# Altium schematic sheet Power.SchDoc
size A; SheetNumber: 8; SheetTotal: 15
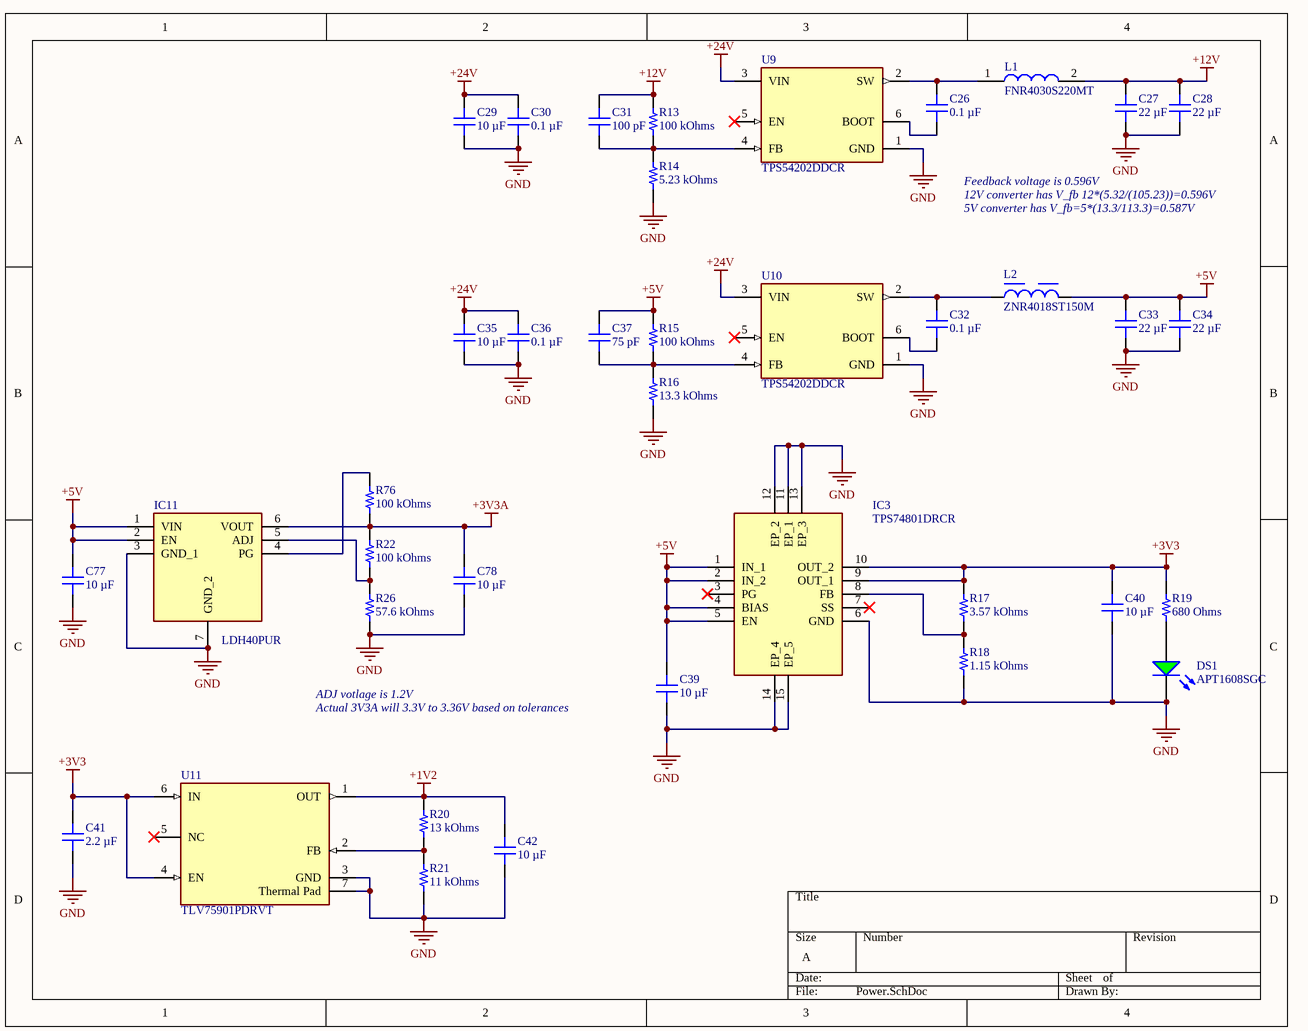
[diagram p0: Power.SchDoc]

## Parts
C26  0.1 µF  [MURATA GCM155 0402_1005]
C27  22 µF  [CAP 0805_2012]
C28  22 µF  [CAP 0805_2012]
C29  10 µF  [CAP 0805_2012]
C30  0.1 µF  [CAP 0402_1005]
C31  100 pF  [CAP 0402_1005]
C32  0.1 µF  [MURATA GCM155 0402_1005]
C33  22 µF  [CAP 0805_2012]
C34  22 µF  [CAP 0805_2012]
C35  10 µF  [CAP 0805_2012]
C36  0.1 µF  [CAP 0402_1005]
C37  75 pF  [MURATA GCM155 0402_1005]
C39  10 µF  [CAP 0402_1005]
C40  10 µF  [CAP 0402_1005]
C41  2.2 µF  [CAP 0402_1005]
C42  10 µF  [CAP 0402_1005]
C77  10 µF  [CAP 0402_1005]
C78  10 µF  [CAP 0402_1005]
DS1  APT1608SGC  [KING-APT1608SGC_V]
IC3  TPS74801DRCR  [TPS74801DRCR]
IC11  LDH40PUR  [SON65P200X200X80-7N]
L1  FNR4030S220MT  [VLCF4020]
L2  ZNR4018ST150M  [WE-LQS_4025]
R13  100 kOhms  [RES 0402_1005]
R14  5.23 kOhms  [RES 0402_1005]
R15  100 kOhms  [RES 0402_1005]
R16  13.3 kOhms  [YAGEO RES 0402_1005]
R17  3.57 kOhms  [YAGEO RES 0402_1005]
R18  1.15 kOhms  [RES 0402_1005]
R19  680 Ohms  [YAGEO RES 0402_1005]
R20  13 kOhms  [YAGEO RES 0402_1005]
R21  11 kOhms  [RES 0402_1005]
R22  100 kOhms  [RES 0402_1005]
R26  57.6 kOhms  [RES 0402_1005]
R76  100 kOhms  [RES 0402_1005]
U9  TPS54202DDCR  [FP-DDC0006A-IPC_B]
U10  TPS54202DDCR  [FP-DDC0006A-IPC_B]
U11  TLV75901PDRVT  [FP-DRV0006A-IPC_B]

## Nets
+1V2: C42.2 R20.2 U11.1(OUT)
+3V3: C40.2 C41.2 IC3.9(OUT_1) IC3.10(OUT_2) R17.2 R19.2 U11.4(EN) U11.6(IN)
+3V3A: C78.2 IC11.6(VOUT) R22.2 R76.1
+5V: C33.2 C34.2 C37.2 C39.2 C77.2 IC3.1(IN_1) IC3.2(IN_2) IC3.4(BIAS) IC3.5(EN) IC11.1(VIN) IC11.2(EN) L2.2 R15.2
+12V: C27.2 C28.2 C31.2 L1.2 R13.2
+24V: C29.2 C30.2 C35.2 C36.2 U9.3(VIN) U10.3(VIN)
GND: C27.1 C28.1 C29.1 C30.1 C33.1 C34.1 C35.1 C36.1 C39.1 C40.1 C41.1 C42.1 C77.1 C78.1 DS1.2(K) IC3.6(GND) IC3.11(EP_1) IC3.12(EP_2) IC3.13(EP_3) IC3.14(EP_4) IC3.15(EP_5) IC11.3(GND_1) IC11.7(GND_2) R14.1 R16.1 R18.1 R21.1 R26.1 U9.1(GND) U10.1(GND) U11.3(GND) U11.7(Thermal_Pad)
NetC26_1: C26.1 U9.6(BOOT)
NetC26_2: C26.2 L1.1 U9.2(SW)
NetC31_1: C31.1 R13.1 R14.2 U9.4(FB)
NetC32_1: C32.1 U10.6(BOOT)
NetC32_2: C32.2 L2.1 U10.2(SW)
NetC37_1: C37.1 R15.1 R16.2 U10.4(FB)
NetDS1_1: DS1.1(A) R19.1
NetIC3_8: IC3.8(FB) R17.1 R18.2
NetIC11_4: IC11.4(PG) R76.2
NetIC11_5: IC11.5(ADJ) R22.1 R26.2
NetR20_1: R20.1 R21.2 U11.2(FB)

Not connected (* = marked no-connect by the designer): IC3 3(PG)* 7(SS)*; U9 5(EN)*; U10 5(EN)*; U11 5(NC)*

## Notes on the sheet
- Feedback voltage is 0.596V
- 12V converter has V_fb 12*(5.32/(105.23))=0.596V
- 5V converter has V_fb=5*(13.3/113.3)=0.587V
- ADJ votlage is 1.2V
- (near C39) Actual 3V3A will 3.3V to 3.36V based on tolerances

## Library data of the parts
C26 C32 = GCM155R71E104KE02D: CAP CER 0.1UF 25V X7R 0402; manufacturer: Murata Electronics; Tolerance: ±10%; Part Number: GCM155R71E104KE02D; Capacitance: 0.1 µF; Applications: Automotive; componentlink1description: Datasheet; componentlink1url: https://search.murata.co.jp/Ceramy/image/img/A01X/G101/ENG/GCM155R71E104KE02-01.pdf; componentlink2description: DigiKey Link; componentlink2url: https://www.digikey.com/en/products/detail/murata-electronics/GCM155R71E104KE02D/7363175; Device Package: 0402 (1005 Metric); lastupdated: 7/20/2024 2:04:19 AM; Lifecycle Status: Active; Minimum Order: 1; Mounting Type: Surface Mount, MLCC; Operating Temperature: -55°C ~ 125°C; Package / Case: 0402 (1005 Metric); packaging: TapeAndReel; partid: 2051; Part Status: Active; price: 0.01; Ratings: AEC-Q200; series: GCM; Size / Dimension: 0.039" L x 0.020" W (1.00mm x 0.50mm); Supplier 1: DigiKey; Supplier Part Number 1: 490-16431-1-ND; Temperature Coefficient: X7R; Thickness (Max): 0.022" (0.55mm); value: 0.1 µF; Voltage - Rated: 25V
C27 C28 C33 C34 = CL21A226MAYNNNE: CAP CER 22UF 25V X5R 0805; manufacturer: Samsung Electro-Mechanics; Tolerance: ±20%; Part Number: CL21A226MAYNNNE; Capacitance: 22 µF; Applications: General Purpose; componentlink1description: Datasheet; componentlink1url: https://media.digikey.com/pdf/Data%20Sheets/Samsung%20PDFs/CL21A226MAYNNNE_Spec.pdf; componentlink2description: DigiKey Link; componentlink2url: https://www.digikey.com/en/products/detail/samsung-electro-mechanics/CL21A226MAYNNNE/10479857; Device Package: 0805 (2012 Metric); lastupdated: 2/9/2024 8:15:02 PM; Lifecycle Status: Active; Minimum Order: 1; Mounting Type: Surface Mount, MLCC; Operating Temperature: -55°C ~ 85°C; Package / Case: 0805 (2012 Metric); packaging: TapeAndReel; partid: 39209; Part Status: Active; price: 0.04; series: CL; Size / Dimension: 0.079" L x 0.049" W (2.00mm x 1.25mm); Supplier 1: DigiKey; Supplier Part Number 1: 1276-CL21A226MAYNNNECT-ND; Temperature Coefficient: X5R; Thickness (Max): 0.057" (1.45mm); value: 22 µF; Voltage - Rated: 25V
C29 C35 = C0805B106K050T: CAP CER 10UF 50V X5R 0805; manufacturer: Holy Stone Enterprise Co., Ltd.; Tolerance: ±10%; Part Number: C0805B106K050T; Capacitance: 10 µF; Applications: General Purpose; componentlink1description: Datasheet; componentlink1url: https://media.digikey.com/pdf/Data%20Sheets/Holy%20Stone/NCC_Series_DS.pdf; componentlink2description: DigiKey Link; componentlink2url: https://www.digikey.com/en/products/detail/holy-stone-enterprise-co-ltd/C0805B106K050T/16894957; Device Package: 0805 (2012 Metric); lastupdated: 2/9/2024 8:14:45 PM; Lifecycle Status: Active; Minimum Order: 1; Mounting Type: Surface Mount, MLCC; Operating Temperature: -55°C ~ 85°C; Package / Case: 0805 (2012 Metric); packaging: TapeAndReel; partid: 48876; Part Status: Active; price: 0.11; series: NCC; Size / Dimension: 0.079" L x 0.049" W (2.00mm x 1.25mm); Supplier 1: DigiKey; Supplier Part Number 1: 4587-C0805B106K050TCT-ND; Temperature Coefficient: X5R; value: 10 µF; Voltage - Rated: 50V
C30 C36 = CGA2B3X5R1H104M050BB: CAP CER 0.1UF 50V X5R 0402; manufacturer: TDK Corporation; Tolerance: ±20%; Part Number: CGA2B3X5R1H104M050BB; Capacitance: 0.1 µF; Applications: Automotive; componentlink1description: Datasheet; componentlink1url: https://product.tdk.com/info/en/catalog/datasheets/mlcc_automotive_general_en.pdf?ref_disty=digikey; componentlink2description: DigiKey Link; componentlink2url: https://www.digikey.com/en/products/detail/tdk-corporation/CGA2B3X5R1H104M050BB/3949450; Device Package: 0402 (1005 Metric); lastupdated: 2/9/2024 8:04:38 PM; Lifecycle Status: Active; Minimum Order: 1; Mounting Type: Surface Mount, MLCC; Operating Temperature: -55°C ~ 85°C; Package / Case: 0402 (1005 Metric); packaging: TapeAndReel; partid: 1792; Part Status: Active; price: 0.01; Ratings: AEC-Q200; series: CGA; Size / Dimension: 0.039" L x 0.020" W (1.00mm x 0.50mm); Supplier 1: DigiKey; Supplier Part Number 1: 445-12214-1-ND; Temperature Coefficient: X5R; Thickness (Max): 0.022" (0.55mm); value: 0.1 µF; Voltage - Rated: 50V
C31 = 500X07N101MV4T: CAP CER 100PF 50V C0G/NP0 0402; manufacturer: Johanson Dielectrics Inc.; Temperature Coefficient: C0G, NP0; Tolerance: ±20%; Part Number: 500X07N101MV4T; Capacitance: 100 pF; Applications: Bypass, Decoupling; componentlink1description: Datasheet; componentlink1url: https://www.johansondielectrics.com/downloads/x2y-filter-and-decoupling-capacitors.pdf; componentlink2description: DigiKey Link; componentlink2url: https://www.digikey.com/en/products/detail/johanson-dielectrics-inc/500X07N101MV4T/2046917; Device Package: 0402 (1005 Metric); Features: Low ESL (X2Y); lastupdated: 2/9/2024 8:04:38 PM; Lifecycle Status: Active; Minimum Order: 1; Mounting Type: Surface Mount, MLCC; Operating Temperature: -55°C ~ 125°C; Package / Case: 0402 (1005 Metric); packaging: TapeAndReel; partid: 1767; Part Status: Active; price: 0.08; series: X2Y®; Size / Dimension: 0.045" L x 0.025" W (1.14mm x 0.64mm); Supplier 1: DigiKey; Supplier Part Number 1: 709-1214-1-ND; Thickness (Max): 0.020" (0.51mm); value: 100 pF; Voltage - Rated: 50V
C37 = GCM1555C1H750FA16D: CAP CER 75PF 50V C0G/NP0 0402; manufacturer: Murata Electronics; Temperature Coefficient: C0G, NP0; Tolerance: ±1%; Part Number: GCM1555C1H750FA16D; Capacitance: 75 pF; Applications: Automotive; componentlink1description: Datasheet; componentlink1url: https://search.murata.co.jp/Ceramy/image/img/A01X/G101/ENG/GCM1555C1H750FA16-01.pdf; componentlink2description: DigiKey Link; componentlink2url: https://www.digikey.com/en/products/detail/murata-electronics/GCM1555C1H750FA16D/7362941; Device Package: 0402 (1005 Metric); lastupdated: 7/20/2024 2:04:17 AM; Lifecycle Status: Active; Minimum Order: 1; Mounting Type: Surface Mount, MLCC; Operating Temperature: -55°C ~ 125°C; Package / Case: 0402 (1005 Metric); packaging: TapeAndReel; partid: 32579; Part Status: Active; price: 0.01; Ratings: AEC-Q200; series: GCM; Size / Dimension: 0.039" L x 0.020" W (1.00mm x 0.50mm); Supplier 1: DigiKey; Supplier Part Number 1: 490-GCM1555C1H750FA16DCT-ND; Thickness (Max): 0.022" (0.55mm); value: 75 pF; Voltage - Rated: 50V
C39 C40 C42 C77 C78 = CL05A106MP8NUB8: CAP CER 10UF 10V X5R 0402; manufacturer: Samsung Electro-Mechanics; Tolerance: ±20%; Part Number: CL05A106MP8NUB8; Capacitance: 10 µF; Applications: Acoustic Noise Reduction; componentlink1description: Datasheet; componentlink1url: http://www.samsungsem.com/kr/support/product-search/mlcc/CL05A106MP8NUB8.jsp; componentlink2description: DigiKey Link; componentlink2url: https://www.digikey.com/en/products/detail/samsung-electro-mechanics/CL05A106MP8NUB8/5961314; Device Package: 0402 (1005 Metric); lastupdated: 2/9/2024 8:04:38 PM; Lifecycle Status: Active; Minimum Order: 1; Mounting Type: Surface Mount, MLCC; Operating Temperature: -55°C ~ 85°C; Package / Case: 0402 (1005 Metric); packaging: TapeAndReel; partid: 1758; Part Status: Active; price: 0.06; series: CL; Size / Dimension: 0.039" L x 0.020" W (1.00mm x 0.50mm); Supplier 1: DigiKey; Supplier Part Number 1: 1276-6830-1-ND; Temperature Coefficient: X5R; Thickness (Max): 0.035" (0.90mm); value: 10 µF; Voltage - Rated: 10V
C41 = CL05A225KO5NQNC: CAP CER 2.2UF 16V X5R 0402; manufacturer: Samsung Electro-Mechanics; Tolerance: ±10%; Part Number: CL05A225KO5NQNC; Capacitance: 2.2 µF; Applications: General Purpose; componentlink1description: Datasheet; componentlink1url: http://www.samsungsem.com/kr/support/product-search/mlcc/CL05A225KO5NQNC.jsp; componentlink2description: DigiKey Link; componentlink2url: https://www.digikey.com/en/products/detail/samsung-electro-mechanics/CL05A225KO5NQNC/3887119; Device Package: 0402 (1005 Metric); lastupdated: 2/9/2024 8:04:38 PM; Lifecycle Status: Active; Minimum Order: 1; Mounting Type: Surface Mount, MLCC; Operating Temperature: -55°C ~ 85°C; Package / Case: 0402 (1005 Metric); packaging: TapeAndReel; partid: 1761; Part Status: Active; price: 0.03; series: CL; Size / Dimension: 0.039" L x 0.020" W (1.00mm x 0.50mm); Supplier 1: DigiKey; Supplier Part Number 1: 1276-1461-1-ND; Temperature Coefficient: X5R; Thickness (Max): 0.022" (0.55mm); value: 2.2 µF; Voltage - Rated: 16V
DS1 = CMP-2000-05789-1: Super Bright Green LED, 62.5 mW, 25 mA, -40 to 85 degC, 2-Pin SMD, RoHS, Tape and Reel; Manufacturer: Kingbright; Online Catalog: 0603RectanglewithFlatTopChipLEDs; Wavelength - Dominant: 568nm; Wavelength - Peak: 565nm; Voltage - Forward (Vf) (Typ): 2.2V; Lens Type: Clear; Other Names: 754-1121-2; Millicandela Rating: 15mcd; Catalog Drawings: APT1608SeriesTop / APT1608SeriesSide; Lens Style/Size: RectanglewithFlatTop,1.2mmx0.8mm; Current - Test: 20mA; 3D Model: APT1608x.sldprt / APT1608x.pro / APT1608x.igs / APT1608x.stp; Viewing Angle: 120°; Package / Case: 0603(1608Metric); Category: Optoelectronics; Package Description: 2-Pin Surface Mount Device, Body 0.8 x 1.6 mm; Mounting Type: SurfaceMount; Color: Green; Height: 0.75mm; Datasheet Version: Rev. 16B, 02/2012; Family: LEDIndication-Discrete; Manufacturer URL: http://www.kingbright.com/; Package Reference: APT1608SGC; Datasheet URL: https://datasheet.ciiva.com/2113/apt1608sgc-2113808.pdf; Mounting Technology: SurfaceMount; Packaging: Tape&Reel(TR); Standard Package: 2,000; Size / Dimension: 1.60mmLx0.80mmW
IC3 = TPS74801DRCR: Integrated Circuit; Manufacturer_Name: Texas Instruments; Datasheet Link: https://www.ti.com/lit/gpn/TPS74801; Height: 1mm; Manufacturer_Part_Number: TPS74801DRCR; Mouser Part Number: 595-TPS74801DRCR; Mouser Price/Stock: https://www.mouser.co.uk/ProductDetail/Texas-Instruments/TPS74801DRCR?qs=MiEMpo83RV6vgm8Iaojmyg%3D%3D; Arrow Part Number: TPS74801DRCR; Arrow Price/Stock: https://www.arrow.com/en/products/tps74801drcr/texas-instruments?region=nac
IC11 = LDH40PUR: Integrated Circuit; Manufacturer_Name: STMicroelectronics; Datasheet Link: https://www.st.com/resource/en/datasheet/ldh40.pdf; Height: 0.8mm; Manufacturer_Part_Number: LDH40PUR
L1 = VLCF4020T-220MR56: 22uH Magnetic Shielded Inductor 1.4A SMD,4x4mm Fixed Inductors RoHS; Manufacturer_Name: TDK; Datasheet Link: https://product.tdk.com/system/files/dam/doc/product/inductor/inductor/smd/catalog/inductor_commercial_power_vlcf4020_en.pdf; Manufacturer_Part_Number: VLCF4020T-220MR56; Mouser Part Number: 810-VLCF4020T220MR56; Mouser Price/Stock: https://www.mouser.co.uk/ProductDetail/TDK/VLCF4020T-220MR56?qs=O2qRfqcg9D8DoR1uKFMlTA%3D%3D; Arrow Part Number: VLCF4020T-220MR56; Arrow Price/Stock: https://www.arrow.com/en/products/vlcf4020t-220mr56/tdk?region=nac
L2 = CMP-03913-77814858-1: FIXED IND 15uH 1A 250mΩ SMD,4x4mm; Current Rating: 1.45A; Inductance: 15µH; Inductance Tolerance: 20%; DC Resistance (DCR): 132mΩ; Max Operating Temperature: 125°C; Ambient Temperature Range High: 85°C; Length: 4mm; Ambient Temperature Range Low: -40°C; RoHS: Compliant; Height: 2.5mm; Min Operating Temperature: -40°C; NexarPartId: 77814858; Width: 4mm
R13 R15 R22 R76 = RP73PF1E100KBTD: RES 100K OHM 0.1% 1/10W 0402; Manufacturer: TE Connectivity Passive Product; Power (Watts): 0.1W, 1/10W; Temperature Coefficient: ±25ppm/°C; Part Number: RP73PF1E100KBTD; Value: 100 kOhms; ComponentLink1Description: Datasheet; ComponentLink1URL: https://www.te.com/commerce/DocumentDelivery/DDEController?Action=srchrtrv&DocNm=1773272&DocType=DS&DocLang=English; ComponentLink2Description: DigiKey Link; ComponentLink2URL: https://www.digikey.com/en/products/detail/te-connectivity-passive-product/RP73PF1E100KBTD/8261053; Composition: Thin Film; Device Package: 0402 (1005 Metric); Height - Seated (Max): 0.014" (0.35mm); LastUpdated: 2/9/2024 8:30:24 PM; Lifecycle Status: Active; Minimum Order: 1; Number of Terminations: 2; Operating Temperature: -55°C ~ 155°C; Package / Case: 0402 (1005 Metric); Packaging: TapeAndReel; PartId: 2436; Part Status: Active; Price: 0.08; Resistance: 100 kOhms; Series: RP73, Holsworthy; Size / Dimension: 0.039" L x 0.020" W (1.00mm x 0.50mm); Supplier 1: DigiKey; Supplier Part Number 1: A127511CT-ND; Supplier Device Package: 0402; Tolerance: ±0.1%
R14 = ERJ-2RKF5231X: RES SMD 5.23K OHM 1% 1/10W 0402; Manufacturer: Panasonic Electronic Components; Power (Watts): 0.1W, 1/10W; Temperature Coefficient: ±100ppm/°C; Part Number: ERJ-2RKF5231X; Value: 5.23 kOhms; ComponentLink1Description: Datasheet; ComponentLink1URL: https://industrial.panasonic.com/cdbs/www-data/pdf/RDA0000/AOA0000C304.pdf; ComponentLink2Description: DigiKey Link; ComponentLink2URL: https://www.digikey.com/en/products/detail/panasonic-electronic-components/ERJ-2RKF5231X/192387; Composition: Thick Film; Device Package: 0402 (1005 Metric); Features: Automotive AEC-Q200; Height - Seated (Max): 0.016" (0.40mm); LastUpdated: 2/9/2024 8:30:18 PM; Lifecycle Status: Active; Minimum Order: 1; Number of Terminations: 2; Operating Temperature: -55°C ~ 155°C; Package / Case: 0402 (1005 Metric); Packaging: CutTape; PartId: 3829; Part Status: Active; Price: 0.01; Ratings: AEC-Q200; Resistance: 5.23 kOhms; Series: ERJ-2RK; Size / Dimension: 0.039" L x 0.020" W (1.00mm x 0.50mm); Supplier 1: DigiKey; Supplier Part Number 1: P5.23KLCT-ND; Supplier Device Package: 0402; Tolerance: ±1%
R16 = RC0402FR-0713K3L: RES 13.3K OHM 1% 1/16W 0402; Manufacturer: Yageo; Power (Watts): 0.063W, 1/16W; Temperature Coefficient: ±100ppm/°C; Part Number: RC0402FR-0713K3L; Value: 13.3 kOhms; ComponentLink1Description: Datasheet; ComponentLink1URL: https://www.yageo.com/upload/media/product/productsearch/datasheet/rchip/PYu-RC_Group_51_RoHS_L_10.pdf; ComponentLink2Description: DigiKey Link; ComponentLink2URL: https://www.digikey.com/en/products/detail/yageo/RC0402FR-0713K3L/5280834; Composition: Thick Film; Device Package: 0402 (1005 Metric); Features: Moisture Resistant; Height - Seated (Max): 0.016" (0.40mm); LastUpdated: 8/31/2025 3:04:18 PM; Lifecycle Status: Active; Minimum Order: 1; Number of Terminations: 2; Operating Temperature: -55°C ~ 155°C; Package / Case: 0402 (1005 Metric); Packaging: CutTape; PartId: 2643; Part Status: Active; Price: 0.01; Resistance: 13.3 kOhms; Series: RC_L; Size / Dimension: 0.039" L x 0.020" W (1.00mm x 0.50mm); Supplier 1: DigiKey; Supplier Part Number 1: YAG2974CT-ND; Supplier Device Package: 0402; Tolerance: ±1%
R17 = RC0402FR-073K57L: RES 3.57K OHM 1% 1/16W 0402; Manufacturer: Yageo; Power (Watts): 0.063W, 1/16W; Temperature Coefficient: ±100ppm/°C; Part Number: RC0402FR-073K57L; Value: 3.57 kOhms; ComponentLink1Description: Datasheet; ComponentLink1URL: https://www.yageo.com/upload/media/product/productsearch/datasheet/rchip/PYu-RC_Group_51_RoHS_L_10.pdf; ComponentLink2Description: DigiKey Link; ComponentLink2URL: https://www.digikey.com/en/products/detail/yageo/RC0402FR-073K57L/5281010; Composition: Thick Film; Device Package: 0402 (1005 Metric); Features: Moisture Resistant; Height - Seated (Max): 0.016" (0.40mm); LastUpdated: 8/31/2025 3:04:18 PM; Lifecycle Status: Active; Minimum Order: 1; Number of Terminations: 2; Operating Temperature: -55°C ~ 155°C; Package / Case: 0402 (1005 Metric); Packaging: CutTape; PartId: 2603; Part Status: Active; Price: 0.01; Resistance: 3.57 kOhms; Series: RC_L; Size / Dimension: 0.039" L x 0.020" W (1.00mm x 0.50mm); Supplier 1: DigiKey; Supplier Part Number 1: YAG3150CT-ND; Supplier Device Package: 0402; Tolerance: ±1%
R18 = TNPW04021K15BYEP: TNPW0402 1K15 0.1% T-13 EP1 E3; Manufacturer: Vishay Dale; Power (Watts): 0.063W, 1/16W; Temperature Coefficient: ±10ppm/°C; Part Number: TNPW04021K15BYEP; Value: 1.15 kOhms; ComponentLink1Description: Datasheet; ComponentLink1URL: https://www.vishay.com/docs/28758/tnpw_e3.pdf; ComponentLink2Description: DigiKey Link; ComponentLink2URL: https://www.digikey.com/en/products/detail/vishay-dale/TNPW04021K15BYEP/18883256; Composition: Thin Film; Device Package: 0402 (1005 Metric); Features: Anti-Sulfur, Automotive AEC-Q200, Moisture Resistant; Height - Seated (Max): 0.016" (0.40mm); LastUpdated: 2/9/2024 8:28:23 PM; Lifecycle Status: Active; Minimum Order: 1; Number of Terminations: 2; Operating Temperature: -55°C ~ 155°C; Package / Case: 0402 (1005 Metric); Packaging: TapeAndReel; PartId: 81440; Price: 0.25; Ratings: AEC-Q200; Resistance: 1.15 kOhms; Series: TNPW e3; Size / Dimension: 0.039" L x 0.020" W (1.00mm x 0.50mm); Supplier 1: DigiKey; Supplier Part Number 1: 541-TNPW04021K15BYEPCT-ND; Supplier Device Package: 0402; Tolerance: ±0.1%
R19 = RC0402FR-07680RL: RES 680 OHM 1% 1/16W 0402; Manufacturer: Yageo; Power (Watts): 0.063W, 1/16W; Temperature Coefficient: ±100ppm/°C; Part Number: RC0402FR-07680RL; Value: 680 Ohms; ComponentLink1Description: Datasheet; ComponentLink1URL: https://www.yageo.com/upload/media/product/productsearch/datasheet/rchip/PYu-RC_Group_51_RoHS_L_10.pdf; ComponentLink2Description: DigiKey Link; ComponentLink2URL: https://www.digikey.com/en/products/detail/yageo/RC0402FR-07680RL/726654; Composition: Thick Film; Device Package: 0402 (1005 Metric); Features: Moisture Resistant; Height - Seated (Max): 0.016" (0.40mm); LastUpdated: 8/31/2025 3:04:18 PM; Lifecycle Status: Active; Minimum Order: 1; Number of Terminations: 2; Operating Temperature: -55°C ~ 155°C; Package / Case: 0402 (1005 Metric); Packaging: CutTape; PartId: 2599; Part Status: Active; Price: 0.01; Resistance: 680 Ohms; Series: RC_L; Size / Dimension: 0.039" L x 0.020" W (1.00mm x 0.50mm); Supplier 1: DigiKey; Supplier Part Number 1: 311-680LRCT-ND; Supplier Device Package: 0402; Tolerance: ±1%
R20 = RC0402FR-0713KL: RES 13K OHM 1% 1/16W 0402; Manufacturer: Yageo; Power (Watts): 0.063W, 1/16W; Temperature Coefficient: ±100ppm/°C; Part Number: RC0402FR-0713KL; Value: 13 kOhms; ComponentLink1Description: Datasheet; ComponentLink1URL: https://www.yageo.com/upload/media/product/productsearch/datasheet/rchip/PYu-RC_Group_51_RoHS_L_10.pdf; ComponentLink2Description: DigiKey Link; ComponentLink2URL: https://www.digikey.com/en/products/detail/yageo/RC0402FR-0713KL/726539; Composition: Thick Film; Device Package: 0402 (1005 Metric); Features: Moisture Resistant; Height - Seated (Max): 0.016" (0.40mm); LastUpdated: 8/31/2025 3:04:18 PM; Lifecycle Status: Active; Minimum Order: 1; Number of Terminations: 2; Operating Temperature: -55°C ~ 155°C; Package / Case: 0402 (1005 Metric); Packaging: CutTape; PartId: 2760; Part Status: Active; Price: 0.01; Resistance: 13 kOhms; Series: RC_L; Size / Dimension: 0.039" L x 0.020" W (1.00mm x 0.50mm); Supplier 1: DigiKey; Supplier Part Number 1: 311-13.0KLRCT-ND; Supplier Device Package: 0402; Tolerance: ±1%
R21 = ERJ-2RKF1102X: RES SMD 11K OHM 1% 1/10W 0402; Manufacturer: Panasonic Electronic Components; Power (Watts): 0.1W, 1/10W; Temperature Coefficient: ±100ppm/°C; Part Number: ERJ-2RKF1102X; Value: 11 kOhms; ComponentLink1Description: Datasheet; ComponentLink1URL: https://industrial.panasonic.com/cdbs/www-data/pdf/RDA0000/AOA0000C304.pdf; ComponentLink2Description: DigiKey Link; ComponentLink2URL: https://www.digikey.com/en/products/detail/panasonic-electronic-components/ERJ-2RKF1102X/192089; Composition: Thick Film; Device Package: 0402 (1005 Metric); Features: Automotive AEC-Q200; Height - Seated (Max): 0.016" (0.40mm); LastUpdated: 2/9/2024 8:30:07 PM; Lifecycle Status: Active; Minimum Order: 1; Number of Terminations: 2; Operating Temperature: -55°C ~ 155°C; Package / Case: 0402 (1005 Metric); Packaging: CutTape; PartId: 6474; Part Status: Active; Price: 0.01; Ratings: AEC-Q200; Resistance: 11 kOhms; Series: ERJ-2RK; Size / Dimension: 0.039" L x 0.020" W (1.00mm x 0.50mm); Supplier 1: DigiKey; Supplier Part Number 1: P11.0KLCT-ND; Supplier Device Package: 0402; Tolerance: ±1%
R26 = RMCF0402FT57K6: RES 57.6K OHM 1% 1/16W 0402; Manufacturer: Stackpole Electronics Inc; Power (Watts): 0.063W, 1/16W; Temperature Coefficient: ±100ppm/°C; Part Number: RMCF0402FT57K6; Value: 57.6 kOhms; ComponentLink1Description: Datasheet; ComponentLink1URL: https://www.seielect.com/catalog/sei-rmcf_rmcp.pdf; ComponentLink2Description: DigiKey Link; ComponentLink2URL: https://www.digikey.com/en/products/detail/stackpole-electronics-inc/RMCF0402FT57K6/1761716; Composition: Thick Film; Device Package: 0402 (1005 Metric); Features: Automotive AEC-Q200; Height - Seated (Max): 0.016" (0.40mm); LastUpdated: 2/9/2024 8:30:11 PM; Lifecycle Status: Active; Minimum Order: 1; Number of Terminations: 2; Operating Temperature: -55°C ~ 155°C; Package / Case: 0402 (1005 Metric); Packaging: CutTape; PartId: 5441; Part Status: Active; Price: 0.01; Ratings: AEC-Q200; Resistance: 57.6 kOhms; Series: RMCF; Size / Dimension: 0.039" L x 0.020" W (1.00mm x 0.50mm); Supplier 1: DigiKey; Supplier Part Number 1: RMCF0402FT57K6CT-ND; Supplier Device Package: 0402; Tolerance: ±1%
U9 U10 = CMP-04918-000439-1: IC REG BUCK ADJ 2A TSOT23-6; Switching Frequency: 500kHz; Quiescent Current: 40uA; Max Output Voltage: 28V; Output Configuration: Positive; Min Output Voltage: 596mV; Min Input Voltage: 4.5V; Synchronous Rectifier: Yes; Output Type: Adjustable; Number of Outputs: 1; Packaging: Tape and Reel; Case/Package: SOT-23-6; RoHS Compliant: Yes; Max Input Voltage: 28V; Max Operating Temperature: 125°C; Min Operating Temperature: -40°C; Output Current: 2A; Lead Free: Lead Free; Mount: Surface Mount
U11 = CMP-04917-000114-1: IC REG LINEAR POS ADJ 1A 6WSON; RoHS Compliant: Yes